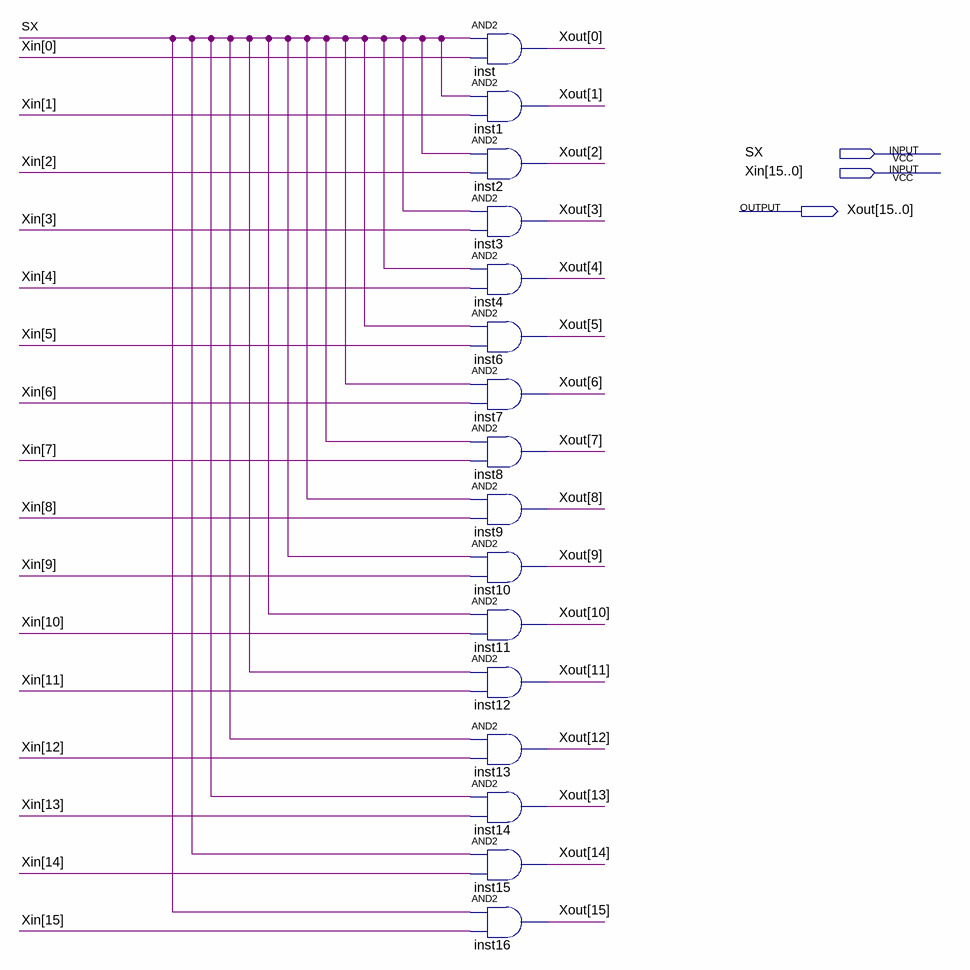
[diagram p0: schematic sheet]
// Quartus schematic alu_x_selector.bdf as structural Verilog: 16 symbols, 3 pins
module alu_x_selector (
  input  SX,
  input  [15:0] Xin,
  output [15:0] Xout
);

  and inst (Xout[0], SX, Xin[0]);
  and inst1 (Xout[1], SX, Xin[1]);
  and inst2 (Xout[2], SX, Xin[2]);
  and inst3 (Xout[3], SX, Xin[3]);
  and inst4 (Xout[4], SX, Xin[4]);
  and inst6 (Xout[5], SX, Xin[5]);
  and inst7 (Xout[6], SX, Xin[6]);
  and inst8 (Xout[7], SX, Xin[7]);
  and inst9 (Xout[8], SX, Xin[8]);
  and inst10 (Xout[9], SX, Xin[9]);
  and inst11 (Xout[10], SX, Xin[10]);
  and inst12 (Xout[11], SX, Xin[11]);
  and inst13 (Xout[12], SX, Xin[12]);
  and inst14 (Xout[13], SX, Xin[13]);
  and inst15 (Xout[14], SX, Xin[14]);
  and inst16 (Xout[15], SX, Xin[15]);
endmodule
